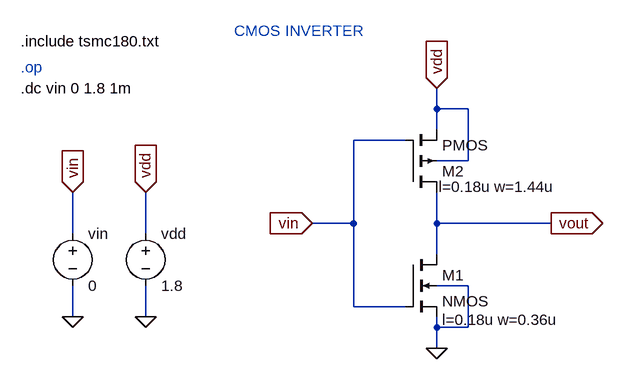
[diagram p0: schematic CMOS_INVERTER.asc]
CMOS_INVERTER.asc, the LTspice schematic file:
Version 4
SHEET 1 880 680
WIRE 16 -112 16 -144
WIRE 64 -112 16 -112
WIRE 16 -80 16 -112
WIRE -32 -64 -112 -64
WIRE 64 -32 64 -112
WIRE 64 -32 16 -32
WIRE -112 64 -112 -64
WIRE -112 64 -176 64
WIRE 16 64 16 16
WIRE 192 64 16 64
WIRE -544 80 -544 16
WIRE -432 80 -432 16
WIRE 16 112 16 64
WIRE 64 160 16 160
WIRE -112 192 -112 64
WIRE -32 192 -112 192
WIRE -544 208 -544 160
WIRE -432 208 -432 160
WIRE 16 224 16 208
WIRE 64 224 64 160
WIRE 64 224 16 224
WIRE 16 256 16 224
FLAG 16 256 0
FLAG 16 -144 vdd
IOPIN 16 -144 In
FLAG 192 64 vout
IOPIN 192 64 Out
FLAG -176 64 vin
IOPIN -176 64 In
FLAG -544 208 0
FLAG -544 16 vin
IOPIN -544 16 In
FLAG -432 208 0
FLAG -432 16 vdd
IOPIN -432 16 In
SYMBOL nmos4 -32 112 R0
WINDOW 123 56 100 Left 2
SYMATTR Value2 l=0.18u w=0.36u
SYMATTR InstName M1
SYMBOL pmos4 -32 16 M180
WINDOW 123 51 8 Left 2
SYMATTR Value2 l=0.18u w=1.44u
SYMATTR InstName M2
SYMBOL voltage -544 64 R0
WINDOW 123 0 0 Left 0
WINDOW 39 0 0 Left 0
SYMATTR InstName vin
SYMATTR Value 0
SYMBOL voltage -432 64 R0
WINDOW 123 0 0 Left 0
WINDOW 39 0 0 Left 0
SYMATTR InstName vdd
SYMATTR Value 1.8
TEXT -624 -176 Left 2 ;.op
TEXT -624 -216 Left 2 !.include tsmc180.txt
TEXT -296 -232 Left 2 ;CMOS INVERTER
TEXT -624 -144 Left 2 !.dc vin 0 1.8 1m

The netlist it stands for:
* CMOS_INVERTER.asc
M1 vout vin 0 0 NMOS l=0.18u w=0.36u
M2 vout vin vdd vdd PMOS l=0.18u w=1.44u
vin vin 0 0
vdd vdd 0 1.8
.model NMOS NMOS
.model PMOS PMOS
.lib standard.mos
* .op
.include tsmc180.txt
* CMOS INVERTER
.dc vin 0 1.8 1m
.backanno
.end